# Altium schematic sheet [7]-H3_POWER.SchDoc
size A4
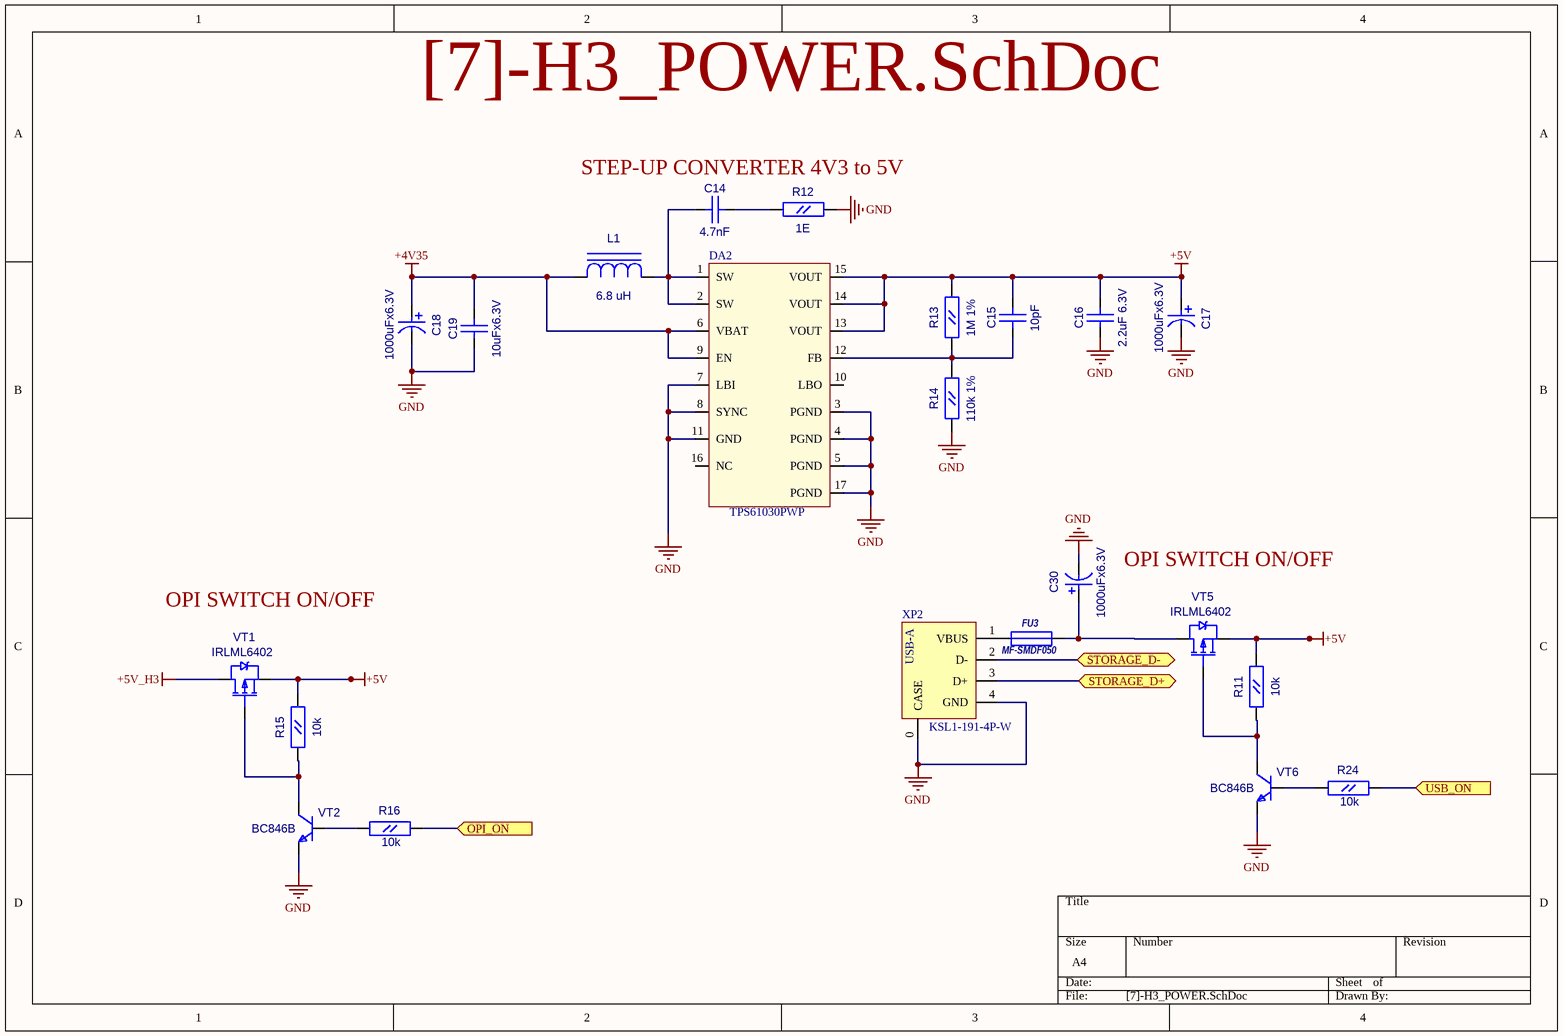
[diagram p0: [7]-H3_POWER.SchDoc]

## Parts
C14  4.7nF  [CC0603]
C15  10pF  [CC0603]
C16  2.2uF 6.3V  [CC0805]
C17  value 1000uFx6.3V  [CC8X3.5]  (hidden comment: CAP0.35)
C18  value 1000uFx6.3V  [CC8X3.5]  (hidden comment: CAP0.35)
C19  10uFx6.3V  [CC0805]
C30  value 1000uFx6.3V  [CC8X3.5]  (hidden comment: CAP0.35)
DA2  TPS61030PWP  [R-PDSO-G16]
FU3  MF-SMDF050  [MF-SMDF]
L1  6.8 uH  [SDR0805]
R11  10k  [RC0603]
R12  1E  [RC0603]
R13  1M 1%  [RC0603]
R14  110k 1%  [RC0603]
R15  10k  [RC0603]
R16  10k  [RC0603]
R24  10k  [RC0603]
VT1  IRLML6402  [SOT-23(123)]
VT2  BC846B  [SOT-23(123)]
VT5  IRLML6402  [SOT-23(123)]
VT6  BC846B  [SOT-23(123)]
XP2  KSL1-191-4P-W  [USB_A_REAR]

## Ports
OPI_ON (in), STORAGE_D+ (bidir), STORAGE_D- (bidir), USB_ON (in)

## Nets
+4V35: C18.1 C19.2(B) DA2.6(VBAT) DA2.9(EN) L1.1(C)
+5V: C15.2(B) C16.2(B) C17.1 DA2.13(VOUT) DA2.14(VOUT) DA2.15(VOUT) R11.2(B) R13.2(B) R15.2(B) VT1.2(S) VT5.2(S)
+5V_H3: VT1.3(D)
GND: C16.1(A) C17.2 C18.2 C19.1(A) C30.2 DA2.3(PGND) DA2.4(PGND) DA2.5(PGND) DA2.7(LBI) DA2.8(SYNC) DA2.11(GND) DA2.17(PGND) R12.2(B) R14.1(A) VT2.2(E) VT6.2(E) XP2.0(CASE) XP2.4(GND)
OPI_ON: R16.2(B) ; port OPI_ON
STORAGE_D+: XP2.3(D+) ; port STORAGE_D+
STORAGE_D-: XP2.2(D-) ; port STORAGE_D-
USB_ON: R24.2(B) ; port USB_ON
NetC14_1: C14.1(A) DA2.1(SW) DA2.2(SW) L1.2(A)
NetC14_2: C14.2(B) R12.1(A)
NetC15_1: C15.1(A) DA2.12(FB) R13.1(A) R14.2(B)
NetC30_1: C30.1 FU3.2 VT5.3(D)
NetFU3_1: FU3.1 XP2.1(VBUS)
NetR11_1: R11.1(A) VT5.1(G) VT6.3(C)
NetR15_1: R15.1(A) VT1.1(G) VT2.3(C)
NetR16_1: R16.1(A) VT2.1(B)
NetR24_1: R24.1(A) VT6.1(B)

Not connected (* = marked no-connect by the designer): DA2 10(LBO) 16(NC)

## Notes on the sheet
- STEP-UP CONVERTER 4V3 to 5V
- OPI SWITCH ON/OFF
- (in symbol USB_A_REAR) USB-A

## Library data of the parts
C14 C15 = CC0603
  C14: Value: 4.7nF
  C15: Value: 10pF
C16 C19 = CC0805
  C16: Value: 2.2uF 6.3V
  C19: Value: 10uFx6.3V
DA2 = TPS61030PWP: Boost converter
FU3 = MF-SMDF: Value: *
L1 = SDR0805: Value: 6.8 uH
R11-R16 R24 = RC0603
  R11 R15 R16 R24: Value: 10k
  R12: Value: 1E
  R13: Value: 1M 1%
  R14: Value: 110k 1%
VT1 VT5 = IRLML6402: HEXFET Power MOSFET; OriginalName: IRLML5103; ComponentField7: Published 8-Jun-2000; Value: IRLML6402
VT2 VT6 = BC846BLT1: ComponentField7: Published 29-Sep-2000; OriginalName: BC846BLT1; Value: BC846B
XP2 = USB_A_REAR: USB A rear side connector; Value: KSL1-191-4P-W